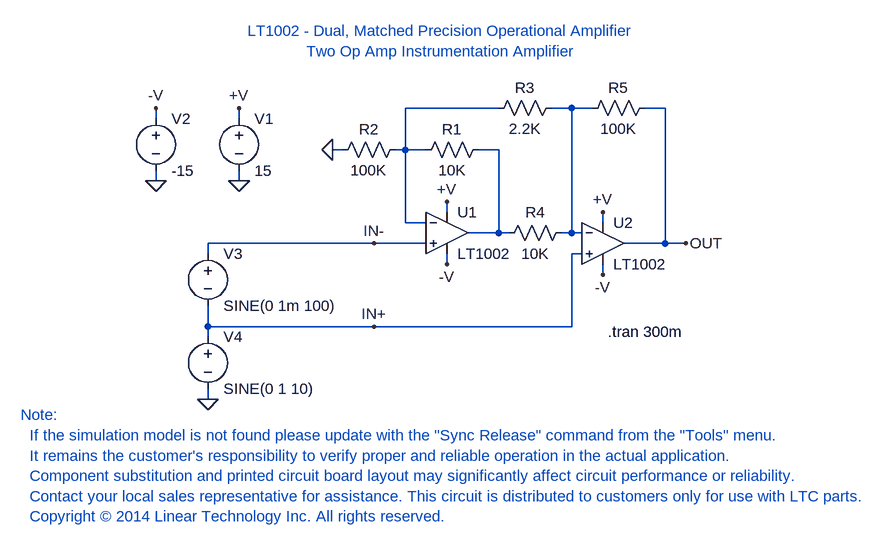
[diagram p0: schematic LT1002_TA10.asc]
LT1002_TA10.asc, the LTspice schematic file:
Version 4
SHEET 1 1192 684
WIRE 272 48 128 48
WIRE 384 48 352 48
WIRE 416 48 384 48
WIRE 528 48 496 48
WIRE -256 64 -256 48
WIRE -128 64 -128 48
WIRE 32 112 16 112
WIRE 128 112 128 48
WIRE 128 112 112 112
WIRE 160 112 128 112
WIRE 272 112 240 112
WIRE -256 160 -256 144
WIRE -128 160 -128 144
WIRE 192 208 192 192
WIRE 128 224 128 112
WIRE 160 224 128 224
WIRE 432 224 432 208
WIRE 272 240 272 112
WIRE 272 240 224 240
WIRE 288 240 272 240
WIRE 384 240 384 48
WIRE 384 240 368 240
WIRE 400 240 384 240
WIRE 80 256 -176 256
WIRE 160 256 80 256
WIRE 528 256 528 48
WIRE 528 256 464 256
WIRE 560 256 528 256
WIRE -176 272 -176 256
WIRE 400 272 384 272
WIRE 192 288 192 272
WIRE 432 304 432 288
WIRE -176 384 -176 352
WIRE 80 384 -176 384
WIRE 384 384 384 272
WIRE 384 384 80 384
WIRE -176 400 -176 384
WIRE -176 496 -176 480
FLAG -128 160 0
FLAG 192 192 +V
FLAG -128 48 +V
FLAG 192 288 -V
FLAG -256 160 0
FLAG -256 48 -V
FLAG 16 112 0
FLAG -176 496 0
FLAG 432 208 +V
FLAG 432 304 -V
FLAG 80 256 IN-
FLAG 80 384 IN+
FLAG 560 256 OUT
SYMBOL voltage -128 48 R0
SYMATTR InstName V1
SYMATTR Value 15
SYMBOL voltage -256 48 R0
SYMATTR InstName V2
SYMATTR Value -15
SYMBOL res 256 96 R90
WINDOW 0 0 56 VBottom 2
WINDOW 3 32 56 VTop 2
SYMATTR InstName R1
SYMATTR Value 10K
SYMBOL res 128 96 R90
WINDOW 0 0 56 VBottom 2
WINDOW 3 32 56 VTop 2
SYMATTR InstName R2
SYMATTR Value 100K
SYMBOL voltage -176 256 R0
SYMATTR InstName V3
SYMATTR Value SINE(0 1m 100)
SYMBOL LT1002 192 176 R0
SYMATTR InstName U1
SYMBOL LT1002 432 192 R0
SYMATTR InstName U2
SYMBOL res 368 32 R90
WINDOW 0 0 56 VBottom 2
WINDOW 3 32 56 VTop 2
SYMATTR InstName R3
SYMATTR Value 2.2K
SYMBOL res 384 224 R90
WINDOW 0 0 56 VBottom 2
WINDOW 3 32 56 VTop 2
SYMATTR InstName R4
SYMATTR Value 10K
SYMBOL res 512 32 R90
WINDOW 0 0 56 VBottom 2
WINDOW 3 32 56 VTop 2
SYMATTR InstName R5
SYMATTR Value 100K
SYMBOL voltage -176 384 R0
SYMATTR InstName V4
SYMATTR Value SINE(0 1 10)
TEXT 440 392 Left 2 !.tran 300m
TEXT 184 -24 Bottom 2 ;LT1002 - Dual, Matched Precision Operational Amplifier\nTwo Op Amp Instrumentation Amplifier
TEXT -464 520 Left 2 ;Note:\n  If the simulation model is not found please update with the "Sync Release" command from the "Tools" menu.\n  It remains the customer's responsibility to verify proper and reliable operation in the actual application.\n  Component substitution and printed circuit board layout may significantly affect circuit performance or reliability.\n  Contact your local sales representative for assistance. This circuit is distributed to customers only for use with LTC parts.\n  Copyright © 2014 Linear Technology Inc. All rights reserved.

The netlist it stands for:
* LT1002_TA10.asc
V1 +V 0 15
V2 -V 0 -15
R1 N003 N001 10K
R2 N001 0 100K
V3 IN- IN+ SINE(0 1m 100)
* U1: LT1002 (symbol LT1002 not available, pins judged from their places): In+=IN- In-=N001 V+=+V V-=-V OUT=N003
* U2: LT1002 (symbol LT1002 not available, pins judged from their places): In+=IN+ In-=N002 V+=+V V-=-V OUT=OUT
R3 N002 N001 2.2K
R4 N002 N003 10K
R5 OUT N002 100K
V4 IN+ 0 SINE(0 1 10)
.tran 300m
* LT1002 - Dual, Matched Precision Operational Amplifier
* Two Op Amp Instrumentation Amplifier
* Note:
*   If the simulation model is not found please update with the "Sync Release" command from the "Tools" menu.
*   It remains the customer's responsibility to verify proper and reliable operation in the actual application.
*   Component substitution and printed circuit board layout may significantly affect circuit performance or reliability.
*   Contact your local sales representative for assistance. This circuit is distributed to customers only for use with LTC parts.
*   Copyright © 2014 Linear Technology Inc. All rights reserved.
.backanno
.end